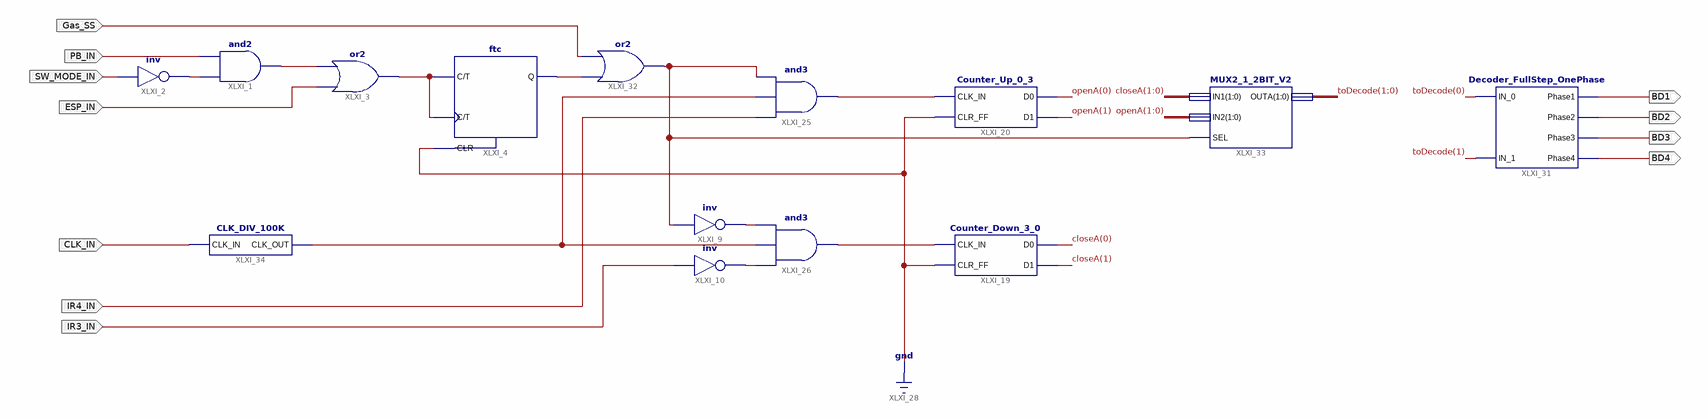
[diagram p0: schematic sheet 1]
// Xilinx ISE schematic Kitchen_Curtain_V4.sch (spartan6) as structural Verilog: 14 symbols, 11 ports
module Kitchen_Curtain_V4 (
  input  PB_IN,
  input  SW_MODE_IN,
  input  ESP_IN,
  input  IR4_IN,
  input  IR3_IN,
  input  CLK_IN,
  input  Gas_SS,
  output BD1,
  output BD2,
  output BD3,
  output BD4
);

  wire XLXN_1, XLXN_6, XLXN_7, XLXN_8, XLXN_9, XLXN_10, XLXN_11, XLXN_17, XLXN_34, XLXN_40;
  wire [1:0] closeA, openA, toDecode;

  and XLXI_1 (XLXN_6, XLXN_1, PB_IN);
  not XLXI_2 (XLXN_1, SW_MODE_IN);
  or XLXI_3 (XLXN_7, ESP_IN, XLXN_6);
  ftc XLXI_4 (.C(XLXN_7), .CLR(1'b0), .T(XLXN_7), .Q(XLXN_34));
  Counter_Down_3_0 XLXI_19 (.CLK_IN(XLXN_9), .CLR_FF(1'b0), .D0(closeA[0]), .D1(closeA[1]));
  Counter_Up_0_3 XLXI_20 (.CLK_IN(XLXN_8), .CLR_FF(1'b0), .D0(openA[0]), .D1(openA[1]));
  and XLXI_26 (XLXN_9, XLXN_11, XLXN_17, XLXN_10);
  and XLXI_25 (XLXN_8, IR4_IN, XLXN_17, XLXN_40);
  not XLXI_9 (XLXN_10, XLXN_40);
  not XLXI_10 (XLXN_11, IR3_IN);
  Decoder_FullStep_OnePhase XLXI_31 (
    .IN_0(toDecode[0]), .IN_1(toDecode[1]), .Phase1(BD1), .Phase2(BD2), .Phase3(BD3), .Phase4(BD4));
  or XLXI_32 (XLXN_40, XLXN_34, Gas_SS);
  MUX2_1_2BIT_V2 XLXI_33 (.IN1(closeA), .IN2(openA), .SEL(XLXN_40), .OUTA(toDecode));
  CLK_DIV_100K XLXI_34 (.CLK_IN(CLK_IN), .CLK_OUT(XLXN_17));
endmodule
